# EAGLE design RFID-RC522-Wemos (EAGLE 7.7.0)
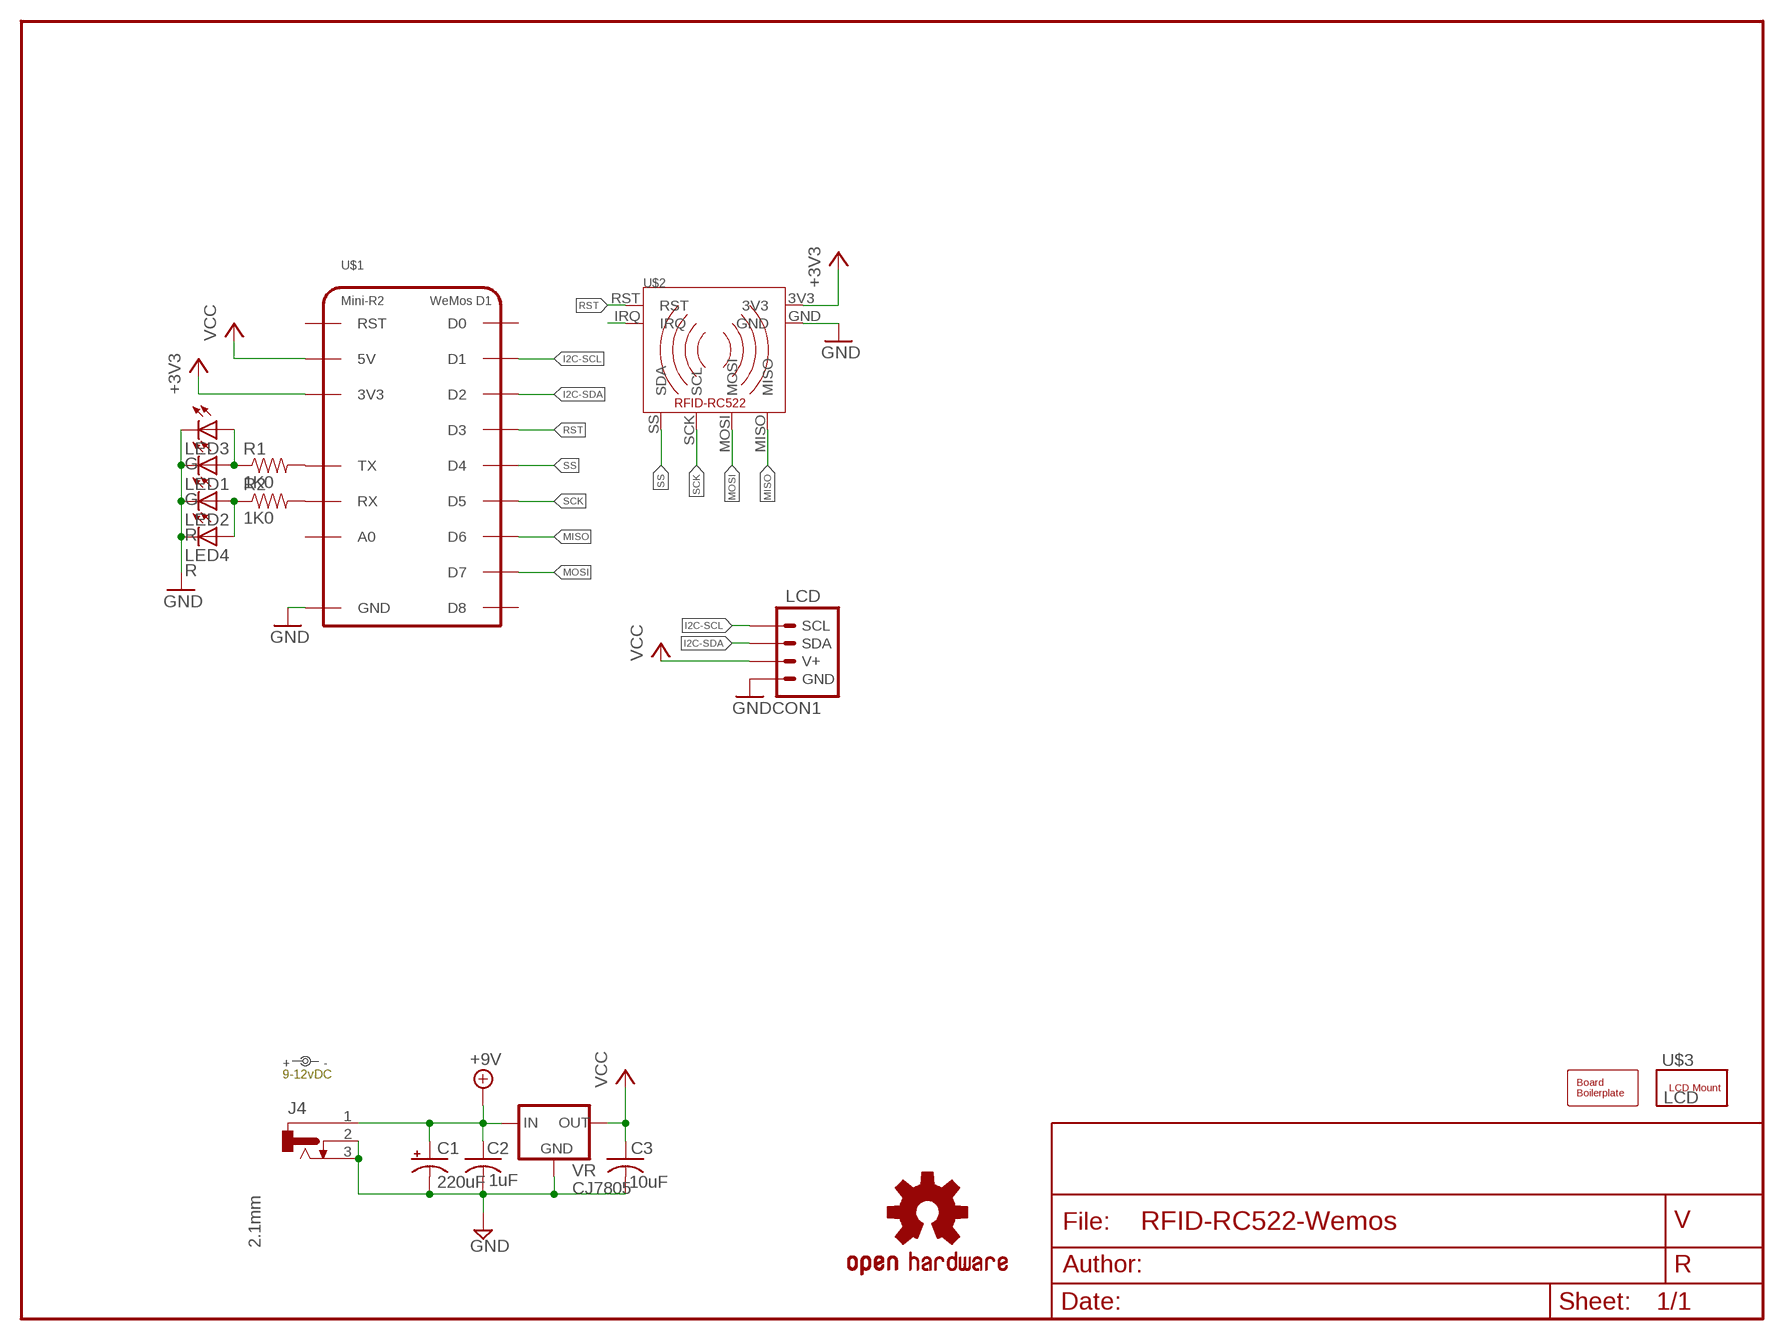
[diagram p0: schematic, sheet 1]

## Parts
BOARD1  8x10  BOARD80X100  [BOARD-DINRAIL-3.17INX10CM]
C1  220uF  CAP-POL0810  [0810-CAP]
C2  1uF  CAP0603  [0603-CAP]
C3  10uF  CAP0603  [0603-CAP]
CON1  LCD  CONNECTOR-I2CLEFT  [I2C-L]
J4  2.1mm  CONNECTOR-DC-POWER-RA  [DCJ0202]
LED1  G  LED0603-LED  [0603-LED]
LED2  R  LED0603-LED  [0603-LED]
LED3  G  LEDLED5MM  [LED5MM]
LED4  R  LEDLED5MM  [LED5MM]
LOGO1  OSHW  DOC-OSHW-LOGOL  [OSHW-LOGO-L]
POWER  9-12vDC  DOC-POWER_LABEL  [PWR_LABEL]
R1  1K0  R0805-RES  [0805-RES]
R2  1K0  R0603-RES  [0603-RES]
U$1  Mini-R2  WEMOS-D1V1  [WEMOS-D1]
U$2  RFIDBACK  [RC522-REVERSE]
U$3  LCD  LCD1602  [LCD-16X2-SILK]
VR  CJ7805  VREG-DPAK-5  [TO-252]

## Nets
+3V3: U$1.3V3 U$2.3V3
+9V [Power]: C1.+ C2.1 J4.1 VR.1(IN)
GND: C1.- C2.2 C3.2 CON1.GND CON1.GND@1(GND) J4.2 J4.3 LED1.C LED2.C LED3.K(C) LED4.K(C) U$1.GND U$2.GND VR.2(GND)
I2C-SCL: CON1.SCL CON1.SCL@1(SCL) U$1.D1
I2C-SDA: CON1.SDA CON1.SDA@1(SDA) U$1.D2
MISO: U$1.D6 U$2.MISO
MOSI: U$1.D7 U$2.MOSI
N$1: R1.2 U$1.TX
N$2: R2.2 U$1.RX
N$3: LED1.A LED3.A R1.1
N$4: LED2.A LED4.A R2.1
N$11: U$2.IRQ
RST: U$1.D3 U$2.RST
SCK: U$1.D5 U$2.SCK(SCL)
SS: U$1.D4 U$2.SS(SDA)
VCC [Power]: C3.1 CON1.V+ CON1.V+@1(V+) U$1.5V VR.3(OUT)
Unconnected: U$1.A0 U$1.D0 U$1.D8 U$1.RST

## Library data of the parts
BOARD1 = SPCoast:BOARD
C1 = SPCoast:CAP-POL*
C2 C3 = SPCoast:CAP*
CON1 = SPCoast:CONNECTOR-I2C
J4 = SPCoast:CONNECTOR-DC-POWER: DC POWER JACK
LED1-LED4 = SPCoast:LED*
LOGO1 = SPCoast:DOC-OSHW-LOGO: Open Source Hardware Logo This logo indicates the piece of hardware it is found on incorporates a OSHW license and/or adheres to the definition of open source hardware found here: http://freedomdefined.org/OSHW Creative Commons - Attribution - ShareAlike 3.0 Creative Commons - Attribution - ShareAlike 3.0 You are free: to Share—to copy, distribute and transmit the work, and to Remix—to adapt the work Under the following conditions: Attribution—You must attribute the work in the manner specified by the author or licensor (but not in any way that suggests that they endorse you or your use of the work.) Share Alike—If you alter, transform, or build upon this work, you may distribute the resulting work only under the same, similar or a compatible license. With the understanding that: Waiver—Any of the above conditions can be waived if you get permission from the copyright holder. Other Rights—In no way are any of the following rights affected by the license: your fair dealing or fair use rights; the author's moral rights; and rights other persons may have either in the work itself or in how the work is used, such as publicity or privacy rights. Notice—For any reuse or distribution, you must make clear to others the license terms of this work. The best way to do that is with a link to http://creativecommons.org/licenses/by-sa/3.0/
POWER = SPCoast:DOC-POWER_LABEL
R1 R2 = SPCoast:R*: Resistor Basic schematic elements and footprints for 0603, 1206, and PTH 1/10th watt (small) resistors.
U$1 = SPCoast:WEMOS-D1
U$2 = SPCoast:RFID
U$3 = SPCoast:LCD
VR = SPCoast:VREG-?-*: Voltage Regulator Standard linear regulator. 7805 uses IGO pinout LM1117 uses GOI pinout

## Net classes
1 Power: width 0.305 mm, clearance 0.254 mm

## Board
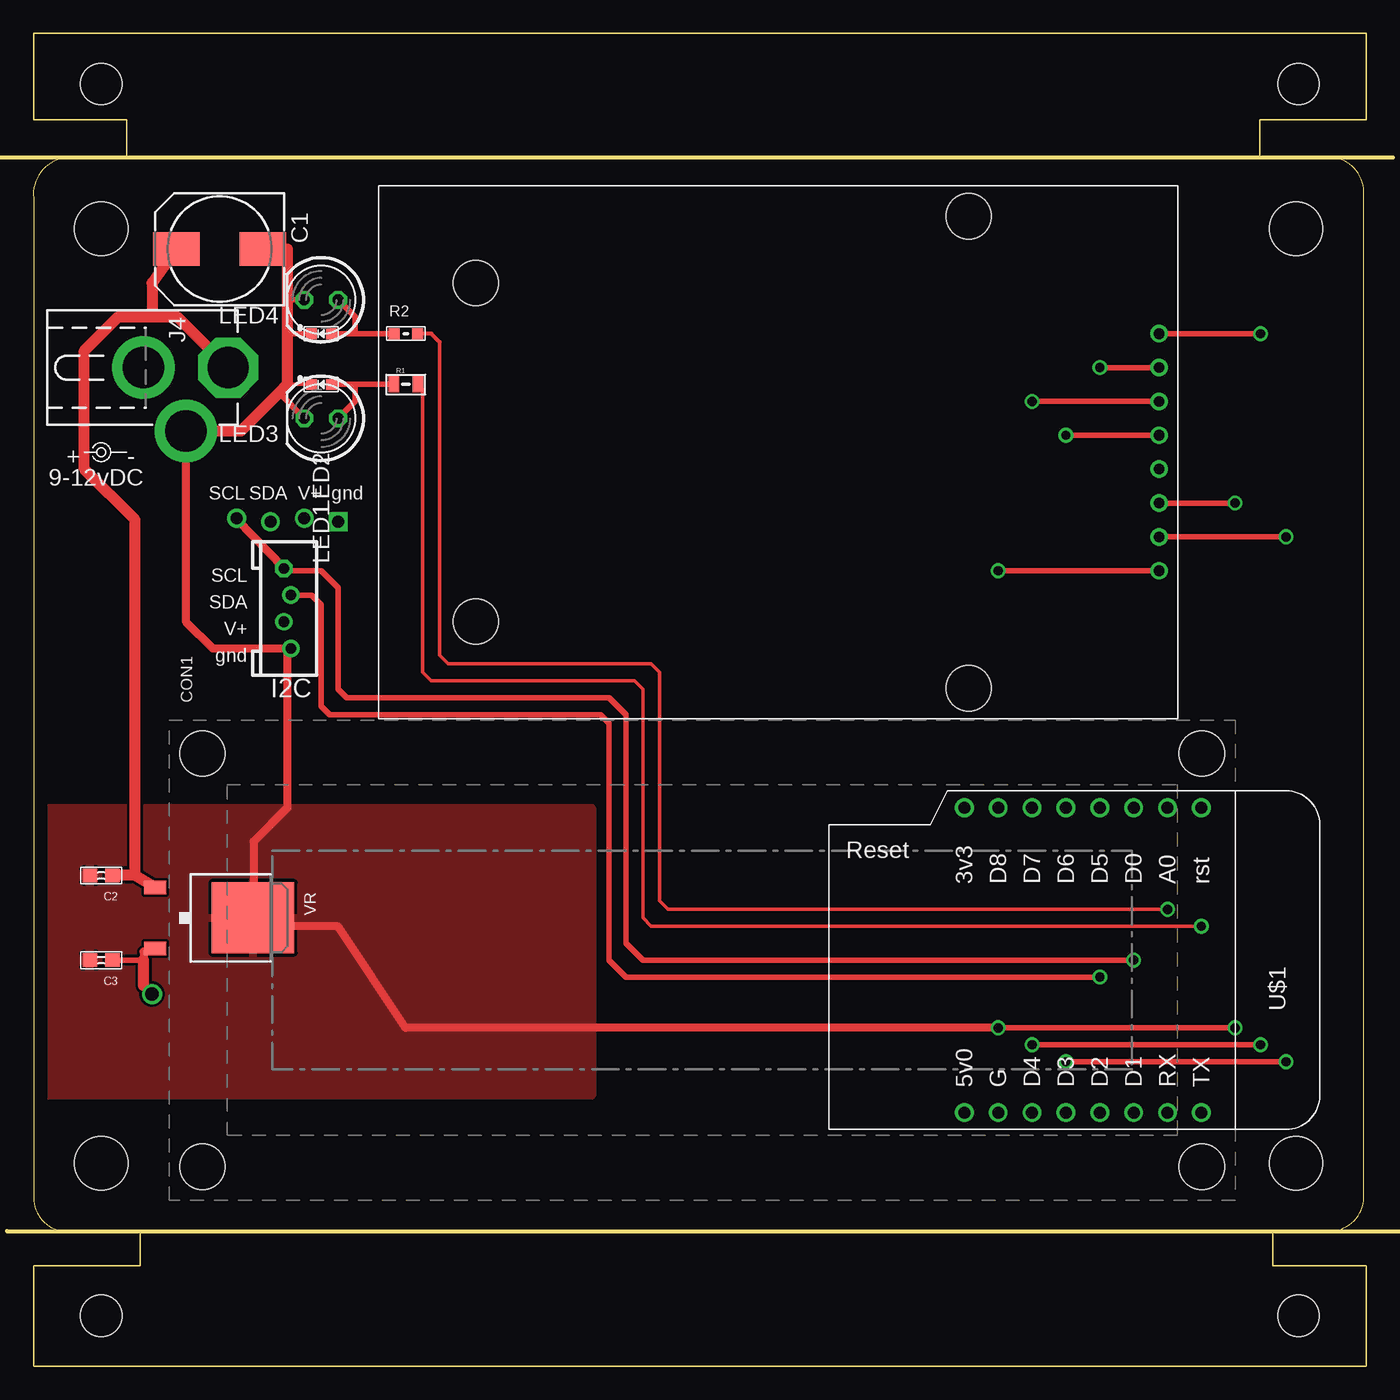
[diagram p1: board, top side]
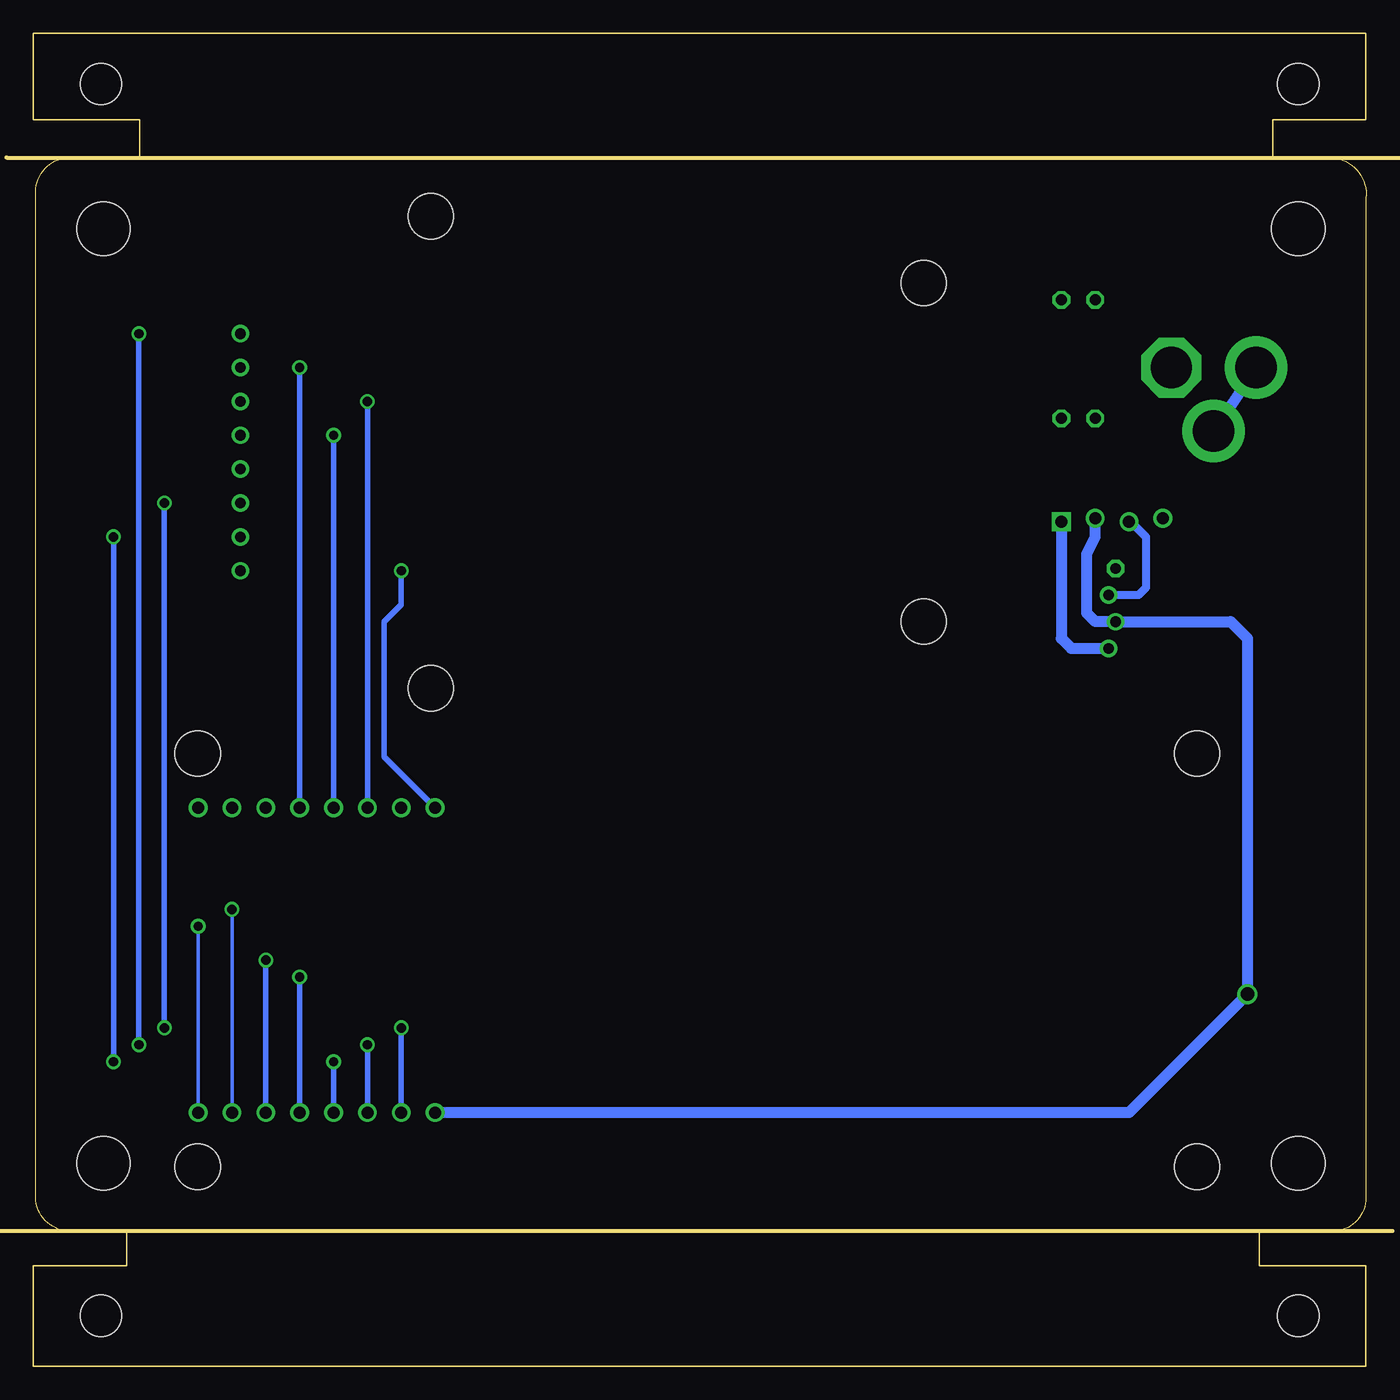
[diagram p2: board, bottom side, seen from below]

Size 100.01 x 100 mm. Coordinates in mm from the lower left corner, seen from the top.
Copper layers (1*16): Top 0.035mm / dielectric 1.5mm / Bottom 0.035mm
Design rules "default": minimum track width 10mil, minimum drill 0.6mm, track to track 8mil, track to pad 8mil, pad to pad 8mil, via to via 8mil, smd to smd 8mil, copper to edge 40mil, drill to drill 8mil, minimum pad ring 10mil, minimum via ring 8mil, stop-mask expansion 4mil, vias tented up to drill 0mil, thermal gap 10mil

### Footprints (pad centres in the part's own frame; a part is rotated, then mirrored left to right if it is on the bottom)
BOARD-DINRAIL-3.17INX10CM = hole 4: 94.742,15.24; 5.08,85.344; 94.742,85.344; 5.08,15.24 | hole 3.1: 5.08,96.19; 94.92,96.19; 5.08,3.81; 94.92,3.81
0810-CAP = smd 3.5 x 2.5: + 3.25,0; - -3.25,0
0603-CAP = smd 1.1 x 1: 1 -0.85,0; 2 0.85,0
I2C-L = drill 0.9 square: GND 3.81,-0.127 | drill 0.8 pad 1.27: GND@1 0.254,-9.635; SDA@1 0.254,-5.635; V+@1 -0.254,-7.635 | drill 0.9: SCL -3.81,0.127; SDA -1.27,-0.127; V+ 1.27,0.127 | drill 0.8 pad 1.27 octagon: SCL@1 -0.254,-3.635
DCJ0202 = drill 3.1 pad 4.5 octagon: 1 0,3.175 | drill 3.1 pad 4.7: 2 4.763,0; 3 0,-3.175
0603-LED = smd 0.8 x 0.8: A 0.75,0; C -0.75,0
LED5MM = drill 0.813 octagon: A 1.27,0; K -1.27,0
0805-RES = smd 0.8 x 1.2: 1 -0.9,0; 2 0.9,0
0603-RES = smd 0.813 x 0.813: 1 -0.889,0; 2 0.889,0
WEMOS-D1 = drill 0.9: 3V3 -11.43,-7.62; 5V 11.43,-7.62; A0 -11.43,7.62; D0 -11.43,5.08; D1 11.43,5.08; D2 11.43,2.54; D3 11.43,0; D4 11.43,-2.54; D5 -11.43,2.54; D6 -11.43,0; D7 -11.43,-2.54; D8 -11.43,-5.08; GND 11.43,-5.08; RST -11.43,10.16; RX 11.43,7.62; TX 11.43,10.16
RC522-REVERSE = drill 0.8: 3V3 -8.89,-28.575; GND -3.81,-28.575; IRQ -1.27,-28.575; MISO 1.27,-28.575; MOSI 3.81,-28.575; RST -6.35,-28.575; SCK 6.35,-28.575; SS 8.89,-28.575 | hole 3.4: 12.7,22.7; -12.7,22.7; 17.7,-14.3; -17.7,-14.3
LCD-16X2-SILK = hole 3.4: -37.5,15.5; -37.5,-15.5; 37.5,15.5; 37.5,-15.5
TO-252 = smd 1.651 x 1.016: 1 -4.826,2.286; 3 -4.826,-2.286 | smd 6.2 x 5.3: 2 2.5,0

### Placement (x,y rotation side)
BOARD1  0.01,0 0 top
C1  13.98,83.82 180 top
C2  5.09,36.83 180 top
C3  5.09,30.48 180 top
CON1  19.06,63.5 0 top
J4  11.44,74.93 270 top
LED1  21.6,73.66 0 top
LED2  21.6,77.47 0 top
LED3  21.6,71.12 0 top
LED4  21.6,80.01 0 top
LOGO1  50.81,68.58 0 top
POWER  5.09,68.58 90 top
R1  27.95,73.66 0 top
R2  27.95,77.47 0 top
U$1  77.48,30.48 270 top
U$2  55.89,68.58 90 top
U$3  50.18,30.48 0 top
VR  13.98,33.66 0 top

### Tracks (layer width: path | path; a pad name or v marks a point on that pad's centre or on a via)
+3V3  (via drill 0.7)
  Top 0.406: v72.4,59.69 U$2.3V3
  Bottom 0.406: U$1.3V3 73.67,45.72 73.67,55.88 72.4,57.15 v72.4,59.69
+9V
  Top 0.813: 7.63,36.83 C2.1 | VR.1 7.63,36.83 | 7.63,36.83 7.63,63.5 3.82,67.31 3.82,76.2 6.36,78.74 8.9,78.74 | 8.9,78.74 10.81,78.74 J4.1 | C1.+ 8.9,81.28 8.9,78.74
GND  (via drill 0.7)
  Top 0.254: LED1.C 19.06,73.66
  Top 0.406: v72.4,25.4 v90.18,25.4 | v90.18,64.77 U$2.GND | LED2.C 19.06,77.47 | LED3.K 18.43,73.03 | LED4.K 19.06,80.01
  Top 0.61: v72.4,25.4 27.95,25.4 22.87,33.02 16.52,33.02 | J4.2 11.44,55.88 13.46,53.87 CON1.GND@1 19.06,53.74 19.06,41.91 16.52,39.37 16.52,33.02 | 16.52,33.02 VR.2
  Top 0.813: C1.- 19.06,83.82 19.06,80.01 19.06,77.47 19.06,73.66 18.43,73.03 15.57,70.17 J4.2
  Bottom 0.406: U$1.GND v72.4,25.4 | v90.18,25.4 v90.18,64.77
  Bottom 0.813: J4.3 J4.2 | CON1.GND 22.87,54.61 22.13,53.87 CON1.GND@1
  pour Top: 0.01,41.91 41.92,41.91 41.92,20.32 0.01,20.32
I2C-SCL  (via drill 0.7)
  Top 0.406: CON1.SCL@1 19.11,59.69 21.6,59.69 22.87,58.42 22.87,50.8 23.51,50.16 43.19,50.16 44.46,48.9 44.46,31.75 45.73,30.48 v82.56,30.48
  Top 0.61: CON1.SCL 15.25,63.55 CON1.SCL@1
  Bottom 0.406: v82.56,30.48 U$1.D1
I2C-SDA  (via drill 0.7)
  Top 0.406: CON1.SDA@1 20.89,57.87 21.6,57.15 21.6,49.53 22.24,48.9 42.56,48.9 43.19,48.26 43.19,30.48 44.46,29.21 v80.02,29.21
  Bottom 0.406: U$1.D2 v80.02,29.21
  Bottom 0.61: CON1.SDA 17.67,63.37 16.52,62.23 16.52,58.42 17.08,57.87 CON1.SDA@1
MISO  (via drill 0.7)
  Top 0.406: v77.48,69.85 U$2.MISO
  Bottom 0.406: U$1.D6 v77.48,69.85
MOSI  (via drill 0.7)
  Top 0.406: v74.94,72.39 U$2.MOSI
  Bottom 0.406: U$1.D7 v74.94,72.39
N$1  (via drill 0.7)
  Top 0.254: v87.64,33.02 46.37,33.02 45.73,33.66 45.73,50.8 45.1,51.44 29.86,51.44 29.22,52.07 29.22,73.29 R1.2
  Bottom 0.254: U$1.TX v87.64,33.02
N$2  (via drill 0.7)
  Top 0.254: 30.49,76.83 30.49,53.34 31.13,52.7 46.37,52.7 47,52.07 47,34.92 47.64,34.29 v85.1,34.29
  Top 0.305: 30.49,76.83 29.86,77.47 R2.2
  Bottom 0.254: v85.1,34.29 U$1.RX
N$3
  Top 0.406: LED1.A 24.14,73.66 | 24.14,73.66 R1.1 | LED3.A 24.14,72.39 24.14,73.66
N$4
  Top 0.406: LED2.A 24.14,77.47 | 24.14,77.47 R2.1 | LED4.A 24.14,78.74 24.14,77.47
RST  (via drill 0.7)
  Top 0.406: v77.48,22.86 v93.99,22.86 | v93.99,62.23 U$2.RST
  Bottom 0.406: U$1.D3 v77.48,22.86 | v93.99,22.86 v93.99,62.23
SCK  (via drill 0.7)
  Top 0.406: v80.02,74.93 U$2.SCK
  Bottom 0.406: U$1.D5 v80.02,74.93
SS  (via drill 0.7)
  Top 0.406: v74.94,24.13 v92.09,24.13 | v92.09,77.47 U$2.SS
  Bottom 0.406: U$1.D4 v74.94,24.13 | v92.09,24.13 v92.09,77.47
VCC  (via drill 1)
  Top 0.406: 8.27,30.48 C3.1
  Top 0.61: VR.3 8.27,31.11 8.27,30.48 | v8.9,27.94 8.27,28.57
  Top 0.813: 8.27,28.57 8.27,30.48
  Bottom 0.61: CON1.V+@1 18.95,55.88
  Bottom 0.813: 18.95,55.88 20.33,55.88 20.97,56.52 20.97,60.96 20.33,62.23 CON1.V+ | CON1.V+@1 10.16,55.87 8.9,54.61 v8.9,27.94 17.79,19.05 U$1.5V

### Text on the board
tDocu: v1.0 | 2017-02 | John Plocher | RC522 RFID WeMOS